# Altium schematic sheet wifi_isolated_uart_old.SchDoc: Isolated_Wifi
size A4; Organization: UNSW Solar Racing Team; Address3: UNSW; Address4: Sydney NSW 2052; Address2: Electrical Engineering; Address1: Room 342
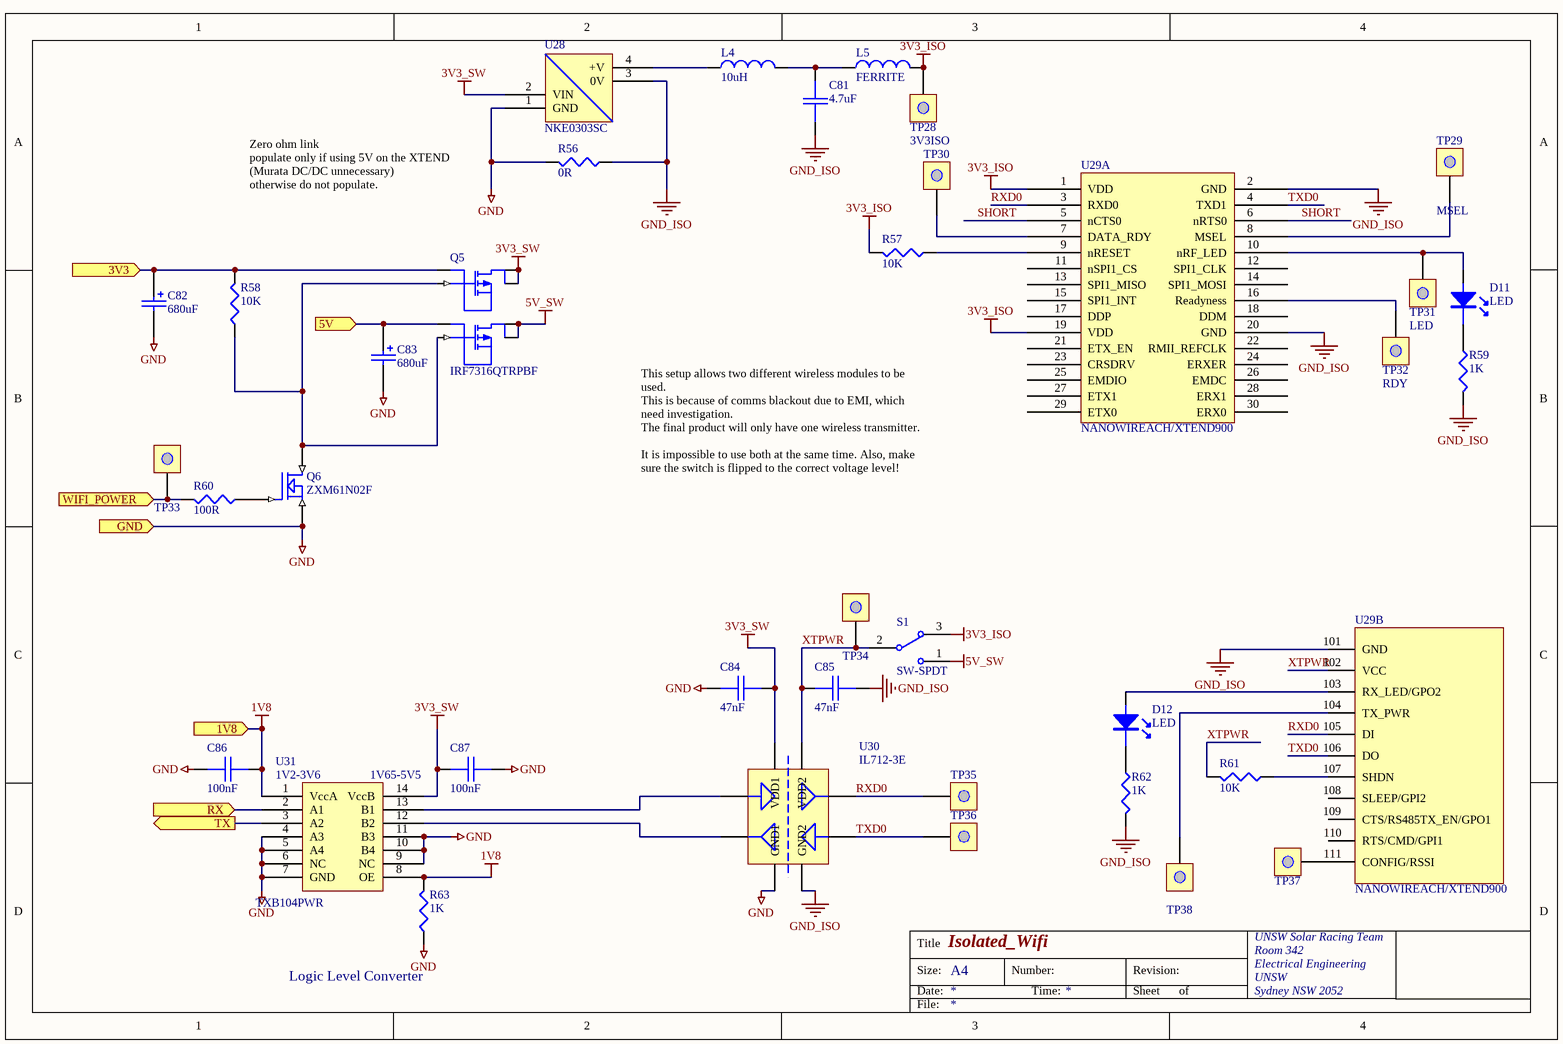
[diagram p0: wifi_isolated_uart_old.SchDoc]

## Parts
C81  4.7uF  [0603]
C82  680uF  [MCCT-CASED]
C83  680uF  [MCCT-CASED]
C84  47nF  [0603]
C85  47nF  [0603]
C86  100nF  [0603]
C87  100nF  [0603]
D11  LED  [0805LED]
D12  LED  [0805LED]
L4  10uH  [1100R]
L5  FERRITE  [0603]
Q5  IRF7316QTRPBF  [SO8]
Q6  ZXM61N02F  [SOT23-3]
R56  0R  [1206]
R57  10K  [0603]
R58  10K  [0603]
R59  1K  [0603]
R60  100R  [0603]
R61  10K  [0603]
R62  1K  [0603]
R63  1K  [0603]
S1  SW-SPDT  [L102011MS02Q]
TP28  3V3ISO  [TESTPOINT]
TP29  MSEL  [TESTPOINT]
TP30  DT_RDY  [TESTPOINT]  (value not drawn)
TP31  LED  [TESTPOINT]
TP32  RDY  [TESTPOINT]
TP33  WIFI_PWR  [TESTPOINT]  (value not drawn)
TP34  XTPWR  [TESTPOINT]  (value not drawn)
TP35  RXD  [TESTPOINT]  (value not drawn)
TP36  TXD  [TESTPOINT]  (value not drawn)
TP37  CFG  [TESTPOINT]  (value not drawn)
TP38  TX_PWR  [TESTPOINT]  (value not drawn)
U28  NKE0303SC  [NPSIP4]
U29  NANOWIREACH/XTEND900  [NWR-XTEND]  (parts A,B of 2)
U30  IL712-3E  [SO8]
U31  TXB104PWR  [TSSOP14-L]

## Ports
1V8 (in), 3V3 (in), 5V (in), GND (in), RX (in), TX (out), WIFI_POWER (in)

## Nets
1V8: C86.2 R63.2 U31.1(VccA) U31.8(OE) ; port 1V8
3V3_ISO: L5.2 R57.2 S1.3 TP28.0(TP) U29.1(VDD) U29.19(VDD)
3V3_SW: C84.1 C87.1 Q5.7(D1) Q5.8(D1) U28.2(VIN) U30.1(VDD1) U31.14(VccB)
5V_SW: Q5.5(D2) Q5.6(D2) S1.1
GND: C82.2 C83.2 C84.2 C86.1 C87.2 Q6.2(S) R56.2 R63.1 U28.1(GND) U30.4(GND1) U31.4(A3) U31.5(A4) U31.6(NC) U31.7(GND) U31.9(NC) U31.10(B4) U31.11(B3) ; port GND
GND_ISO: C81.1 C85.2 R56.1 R59.2 R62.2 U28.3(0V) U29.2(GND) U29.20(GND) U29.101(GND) U30.5(GND2)
3V3: C82.1 Q5.1(S1) R58.2 ; port 3V3
5V: C83.1 Q5.3(S2) ; port 5V
RX: U31.2(A1) ; port RX
RXD0: TP35.0(TP) U29.3(RXD0) U29.105(DI) U30.7(OUT1)
SHORT: U29.5(nCTS0) U29.6(nRTS0)
TX: U31.3(A2) ; port TX
TXD0: TP36.0(TP) U29.4(TXD1) U29.106(DO) U30.6(IN2)
WIFI_POWER: R60.2 TP33.0(TP) ; port WIFI_POWER
XTPWR: C85.1 R61.2 S1.2 TP34.0(TP) U29.102(VCC) U30.8(VDD2)
NetC81_2: C81.2 L4.2 L5.1
NetD11_A: D11.A TP31.0(TP) U29.10(nRF_LED)
NetD11_K: D11.K R59.1
NetD12_A: D12.A U29.103(RX_LED/GPO2)
NetD12_K: D12.K R62.1
NetL4_1: L4.1 U28.4(+V)
NetQ5_2: Q5.2(G1) Q5.4(G2) Q6.3(D) R58.1
NetQ6_1: Q6.1(G) R60.1
NetR57_1: R57.1 U29.9(nRESET)
NetR61_1: R61.1 U29.107(SHDN)
NetTP29_0: TP29.0(TP) U29.8(MSEL)
NetTP30_0: TP30.0(TP) U29.7(DATA_RDY)
NetTP32_0: TP32.0(TP) U29.16(Readyness)
NetTP37_0: TP37.0(TP) U29.111(CONFIG/RSSI)
NetTP38_0: TP38.0(TP) U29.104(TX_PWR)
NetU30_2: U30.2(IN1) U31.13(B1)
NetU30_3: U30.3(OUT2) U31.12(B2)

Not connected (* = marked no-connect by the designer): U29 11(nSPI1_CS) 12(SPI1_CLK) 13(SPI1_MISO) 14(SPI1_MOSI) 15(SPI1_INT) 17(DDP) 18(DDM) 21(ETX_EN) 22(RMII_REFCLK) 23(CRSDRV) 24(ERXER) 25(EMDIO) 26(EMDC) 27(ETX1) 28(ERX1) 29(ETX0) 30(ERX0) 108(SLEEP/GPI2) 109(CTS/RS485TX_EN/GPO1) 110(RTS/CMD/GPI1)

## Notes on the sheet
- Zero ohm link
  populate only if using 5V on the XTEND (Murata DC/DC unnecessary)
  otherwise do not populate.
- This setup allows two different wireless modules to be used.
  This is because of comms blackout due to EMI, which need investigation.
  The final product will only have one wireless transmitter.
  It is impossible to use both at the same time. Also, make sure the switch is flipped to the correct voltage level!
- (near R63) Logic Level Converter
- Title
- Size:
- Date:
- A4
- Number:
- Time:
- Revision:
- Sheet
- of
- File:
- (in symbol TXB0104PWR) 1V2-3V6; 1V65-5V5

## Library data of the parts
C81 C84-C87 = CAP: Capacitor
  C81: Digikey: 587-1441-1-ND; Farnell: 1688134; DigikeyPrice: 0.42; FarnellPrice: 0.585
  C84 C85: Farnell: 8820015; Digikey: 490-3287-1-ND; DigikeyPrice: 0.053; FarnellPrice: 0.085
C82 C83 = CAP POL3: Polarized Capacitor (Surface Mount); Revision: July-2002: Re-released for DXP Platform.; Farnell: 1612292; FarnellPrice: 10.99; Digikey: 478-1787-1-ND; DigikeyPrice: 6.85
L4 = INDUCTOR: 11R103C Murata Inductor; Revision: July-2002: Re-released for DXP Platform.; Farnell: 1710415; FarnellPrice: 0.701; Digikey: 811-2024-ND; DigikeyPrice: 0.31
L5 = INDUCTOR: Revision: July-2002: Re-released for DXP Platform.; Digikey: 732-2389-1-ND; DigikeyPrice: 0.42; Farnell: 1748581; FarnellPrice: 0.567
Q5 = IRF7316QTRPBF: Dual P-type MOSFET IC; Farnell: 1531284; FarnellPrice: 1.47; Digikey: IRF7316QTRPBFCT-ND; DigikeyPrice: 1.8
Q6 = ZXM61N02F: 1.7A, 20V N-Channel Enhancement mode FET; Digikey: ZXM61N02FCT-ND; DigikeyPrice: 0.66; Farnell: 9525270; FarnellPrice: 1.35
R56-R63 = RES1: Resistor
S1 = SW-SPDT: SPDT Subminiature Toggle Switch; DigikeyPrice: 2.11; Digikey: CKC5107-ND
TP28-TP38 = TEST: TEST POINT
U28 = LME1205S(4): 1W subminiature DC/DC; Farnell: 1175765; FarnellPrice: 25.12; Digikey: 811-1428-5-ND; DigikeyPrice: 8.38
U29 = NW/XTEND: Connectone Nano Wireach / Digi Xtend 900; Farnell-XTEND: 1109738; Farnell-NWREACH: 1567709
U30 = IL712: IL712 Optical Isolator; Digikey: 390-1061-5-ND; DigikeyPrice: 5.86; Farnell: 9570608; FarnellPrice: 9.4
U31 = TXB0104PWR: 4 bit bidirectional auto direction sense level translator; Digikey: 296-21929-1-ND; Farnell: 1607891; FarnellPrice: 3.1; DigikeyPrice: 1.93
D11 D12 = LED: Farnell: *; Digikey: 475-1151-1-ND; DigikeyPrice: 0.28